# EAGLE design rapidshark-nmos-quarter-bridge-mk-1.0 (EAGLE 6.5.0)
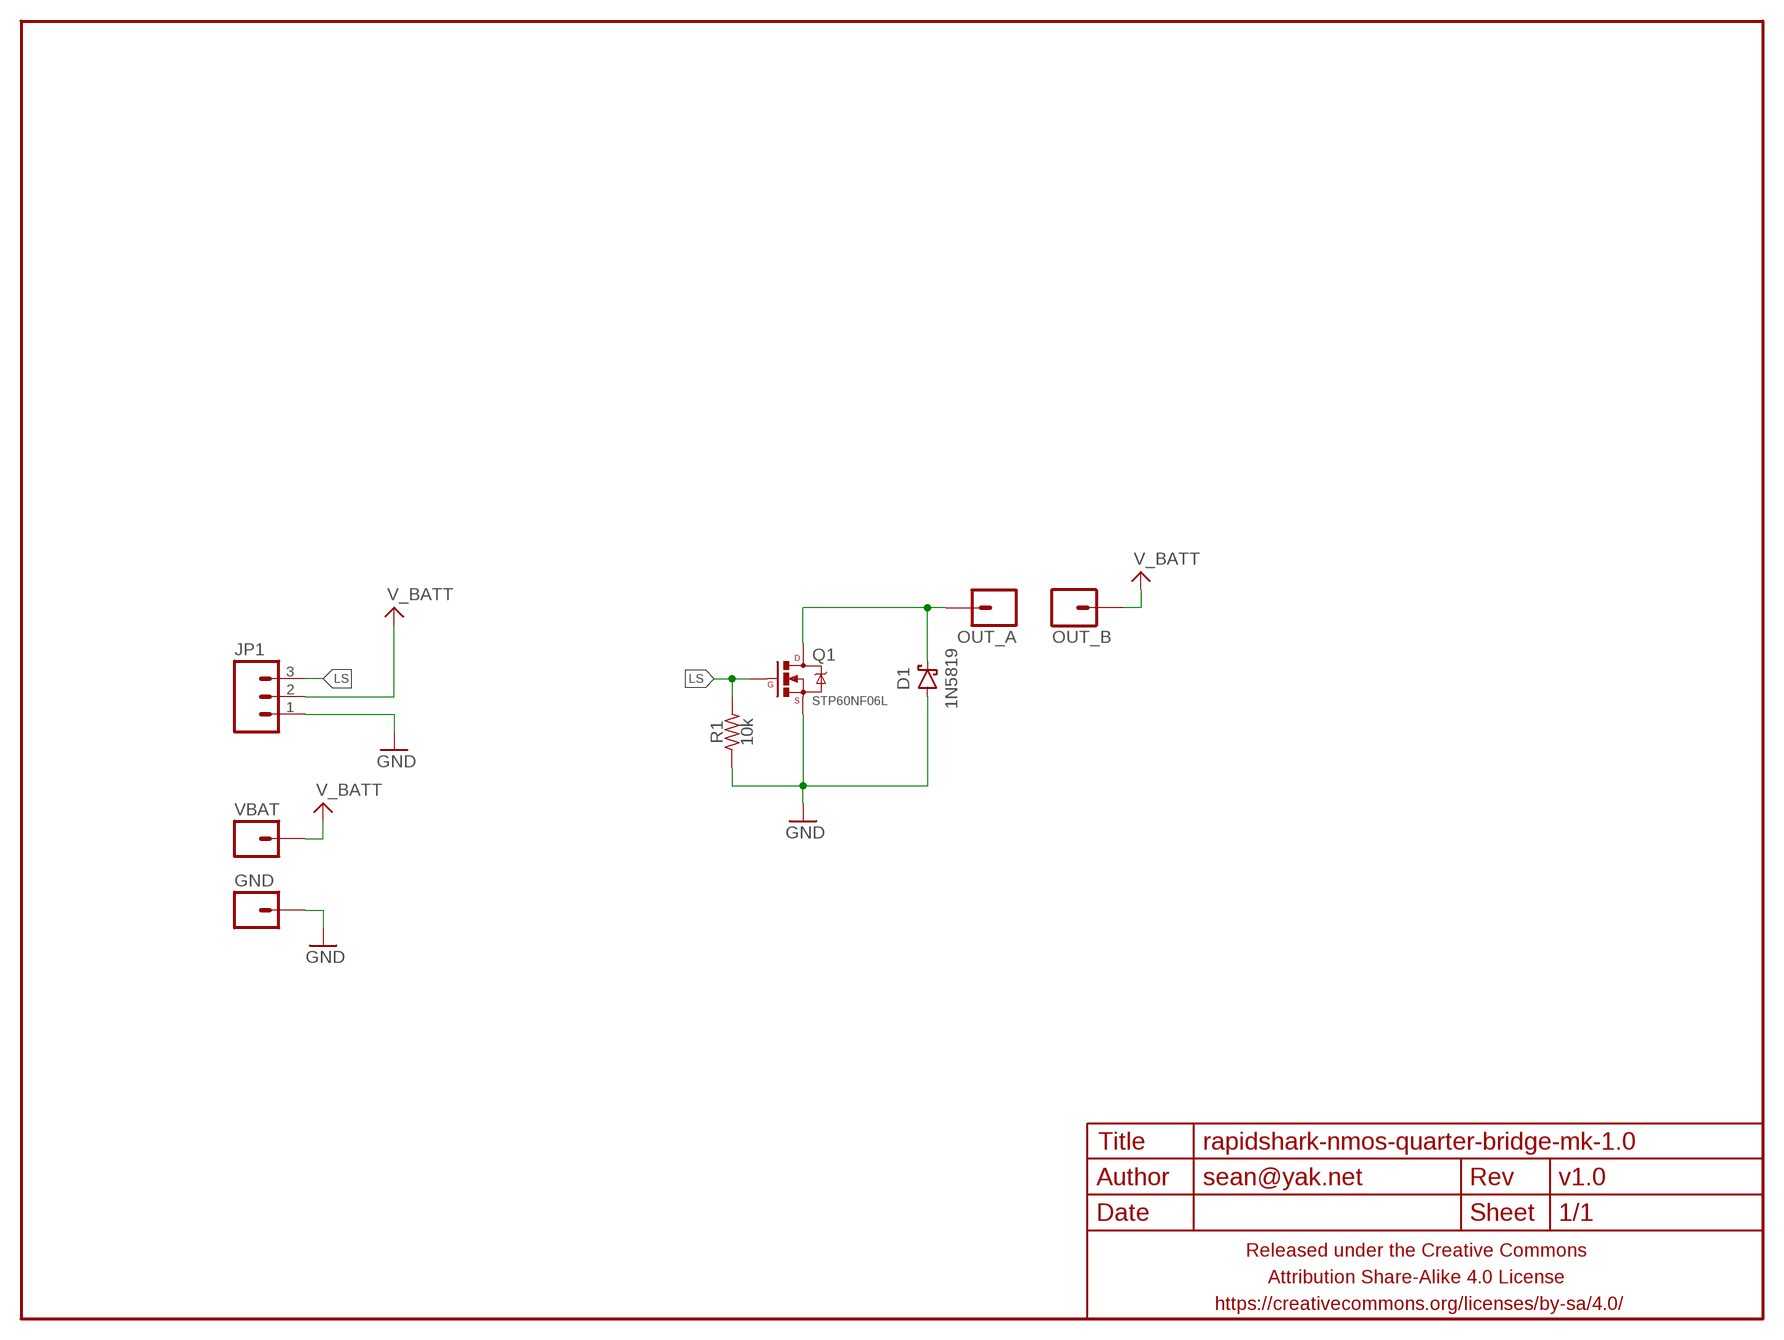
[diagram p0: schematic, sheet 1]

## Parts
D1  1N5819  DIODE-SCHOTTKYPTH-10.16MM  [DIODE-SCHOTTKY-10.16MM]
FRAME1  FRAME-LETTERNO_PACKAGE  [DUMMY]
GND  M0112AWG  [1X01-12AWG]
JP1  M03PTH-CENTERED  [1X03-CENTERED]
OUT_A  M0112AWG  [1X01-12AWG]
OUT_B  M0112AWG  [1X01-12AWG]
Q1  STP60NF06L  MOSFET-NCHANNELTO-220  [TO220-THERMPAD]
R1  10k  RESISTORPTH-AXIAL-5.08MM  [RESISTOR-AXIAL-PTH-5.08MM]
VBAT  M0112AWG  [1X01-12AWG]

## Nets
A: D1.C OUT_A.1 Q1.2@1(D) Q1.2@2(D)
GND: D1.A GND.1 JP1.1 Q1.3(S) R1.P$1
LS: JP1.3 Q1.1(G) R1.P$2
V_BATT: JP1.2 OUT_B.1 VBAT.1

## Library data of the parts
D1 = A_butts:DIODE-SCHOTTKY: Schottky diodes in SFE's production catalog BAT20J 1A 23V 0.62Vf RB751 120mA 40V 0.37Vf PMEG4005EJ 0.5A 40V 0.42Vf MBRA140 1A 40V 0.5Vf B340A 3A 40V SMA
FRAME1 = A_butts:FRAME-LETTER: Schematic Frame Standard 8.5x11 US Letter frame; DESIGNER: sean@yak.net; VERSION: v1.0
GND OUT_A OUT_B VBAT = A_butts:M01: Header 1 Standard 1-pin 0.1" header. Use with straight break away headers (SKU : PRT-00116), right angle break away headers (PRT-00553), swiss pins (PRT-00743), machine pins (PRT-00117), and female headers (PRT-00115).
JP1 = a_parts:M03: Header 3 Standard 3-pin 0.1" header. Use with straight break away headers (SKU : PRT-00116), right angle break away headers (PRT-00553), swiss pins (PRT-00743), machine pins (PRT-00117), and female headers (PRT-00115). Molex polarized connector foot print use with SKU : PRT-08232 with associated crimp pins and housings.
Q1 = A_butts:MOSFET-NCHANNEL: Common NMOSFET Parts MFG P/N Store ID Prod ID FDD8780 TRANS-09984 SI7820DN TRANS-11055 FDS6630A IC-08089 2N7002PW TRANS-11151 FQP30N06L COM-10213 TRANS-10060 BSS123LT1G TRANS-08345 BSS138 TRANS-00830 BS170 2N7000
R1 = a_parts:RESISTOR: RESISTOR, American symbol

## Board
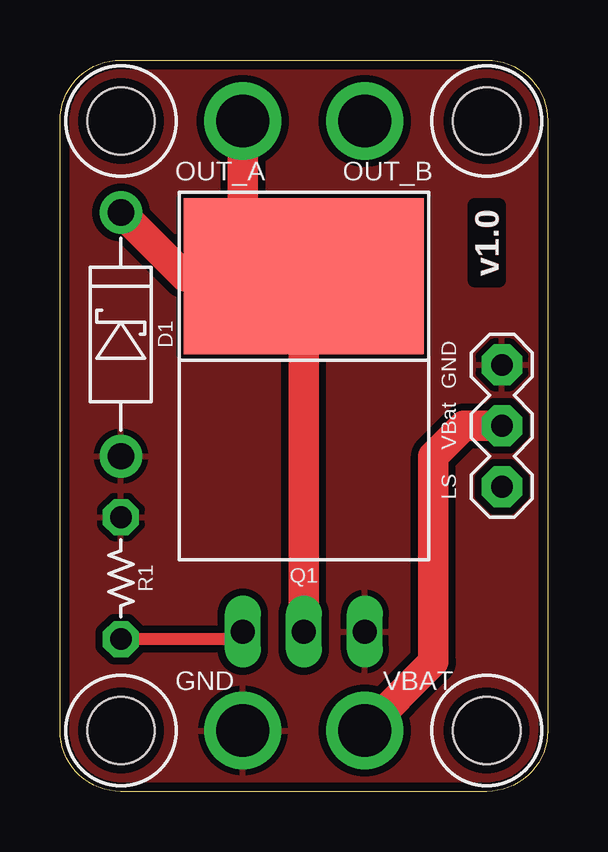
[diagram p1: board, top side]
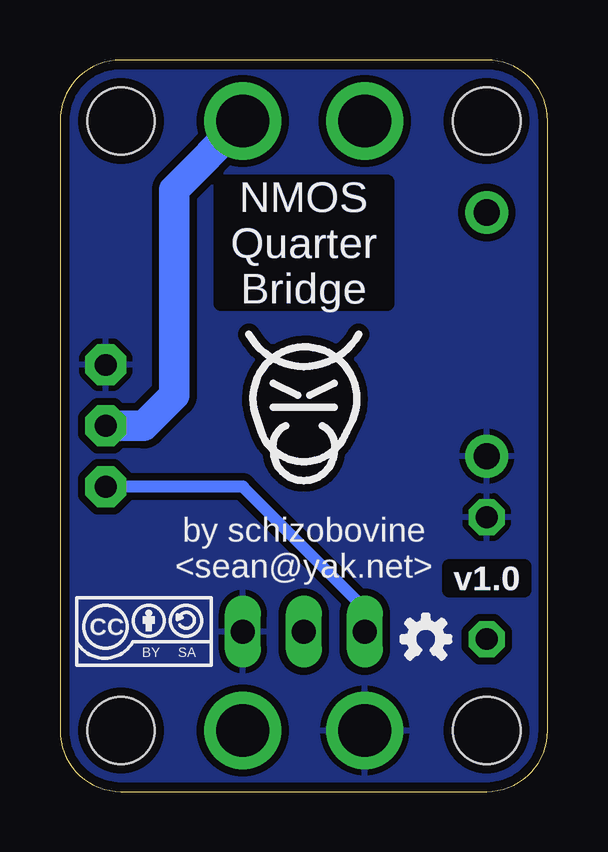
[diagram p2: board, bottom side, seen from below]

Size 20.32 x 30.48 mm. Coordinates in mm from the lower left corner, seen from the top.
Outline: 20.32,27.94 20.32,2.54 arc-90 17.78,0 2.54,0 arc-90 0,2.54 0,27.94 arc-90 2.54,30.48 17.78,30.48 arc-90 20.32,27.94
Copper layers (1*16): Top 0.0356mm / dielectric 1.5011mm / Bottom 0.0356mm
Design rules "LaenPCBOrder_2": minimum track width 6mil, minimum drill 13mil, track to track 6mil, track to pad 6mil, pad to pad 6mil, via to via 6mil, smd to smd 6mil, copper to edge 15mil, drill to drill 6mil, minimum pad ring 7mil, minimum via ring 7mil, stop-mask expansion 3mil, vias tented up to drill 20mil, thermal gap 10mil
Holes 2.8 mm at 2.54,2.54 17.78,2.54 17.78,27.94 2.54,27.94

### Footprints (pad centres in the part's own frame; a part is rotated, then mirrored left to right if it is on the bottom)
DIODE-SCHOTTKY-10.16MM = drill 1.1 pad 1.778: A -5.08,0; C 5.08,0
1X01-12AWG = drill 2.2 pad 3.2: 1 0,0
1X03-CENTERED = drill 0.9 pad 1.7 octagon: 1 -2.54,0; 2 0,0; 3 2.54,0
TO220-THERMPAD = drill 1 long: 1 -2.54,0; 2@2 0,0; 3 2.54,0 | smd 10 x 6.5: 2@1 0,14.81
RESISTOR-AXIAL-PTH-5.08MM = drill 0.9 pad 1.5 octagon: P$1 -2.54,0; P$2 2.54,0

### Placement (x,y rotation side)
D1  2.54,19.05 90 top
FRAME1  0,0 0 bottom
GND  7.62,2.54 0 top
JP1  18.41,15.24 270 top
OUT_A  7.62,27.94 180 top
OUT_B  12.7,27.94 180 top
Q1  10.16,6.67 0 top
R1  2.54,8.89 270 top
U$1  [COW_SMALL_METAL_NOTEXT]  10.16,16.51 0 bottom
U$2  [CC-BY-SA-4.0-NO-URL]  16.83,6.67 0 bottom
U$3  [OSHWLOGO_TINY_SILKONLY]  5.08,6.35 0 bottom
VBAT  12.7,2.54 0 top

### Tracks (layer width: path | path; a pad name or v marks a point on that pad's centre or on a via)
A
  Top 1.27: Q1.2@2 Q1.2@1 | D1.C 5.19,21.48 Q1.2@1 | OUT_A.1 7.62,24.02 Q1.2@1
GND
  pour Top (isolate 0.305, rank 5): 2.54,30.48 17.78,30.48 arc-90 20.32,27.94 20.32,2.54 arc-90 17.78,0 2.54,0 arc-90 0,2.54 0,27.94 arc-90
  pour Bottom (isolate 0.305, rank 5): 17.78,0 2.54,0 arc-90 0,2.54 0,27.94 arc-90 2.54,30.48 17.78,30.48 arc-90 20.32,27.94 20.32,2.54 arc-90
LS
  Top 0.508: Q1.1 7.3,6.35 R1.P$2
  Bottom 0.508: Q1.1 7.62,7.62 12.7,12.7 JP1.3
V_BATT
  Top 1.27: VBAT.1 15.56,5.4 15.56,13.97 16.83,15.24 JP1.2
  Bottom 1.27: OUT_B.1 15.56,25.08 15.56,16.51 16.83,15.24 JP1.2

### Text on the board
Top: v1.0
Bottom: NMOS / Quarter / Bridge | v1.0
tPlace: v1.0 | GND | VBat | LS
bPlace: NMOS / Quarter / Bridge | by schizobovine / <sean@yak.net> | v1.0